# EAGLE schematic main multicore (EAGLE 7.2.0)
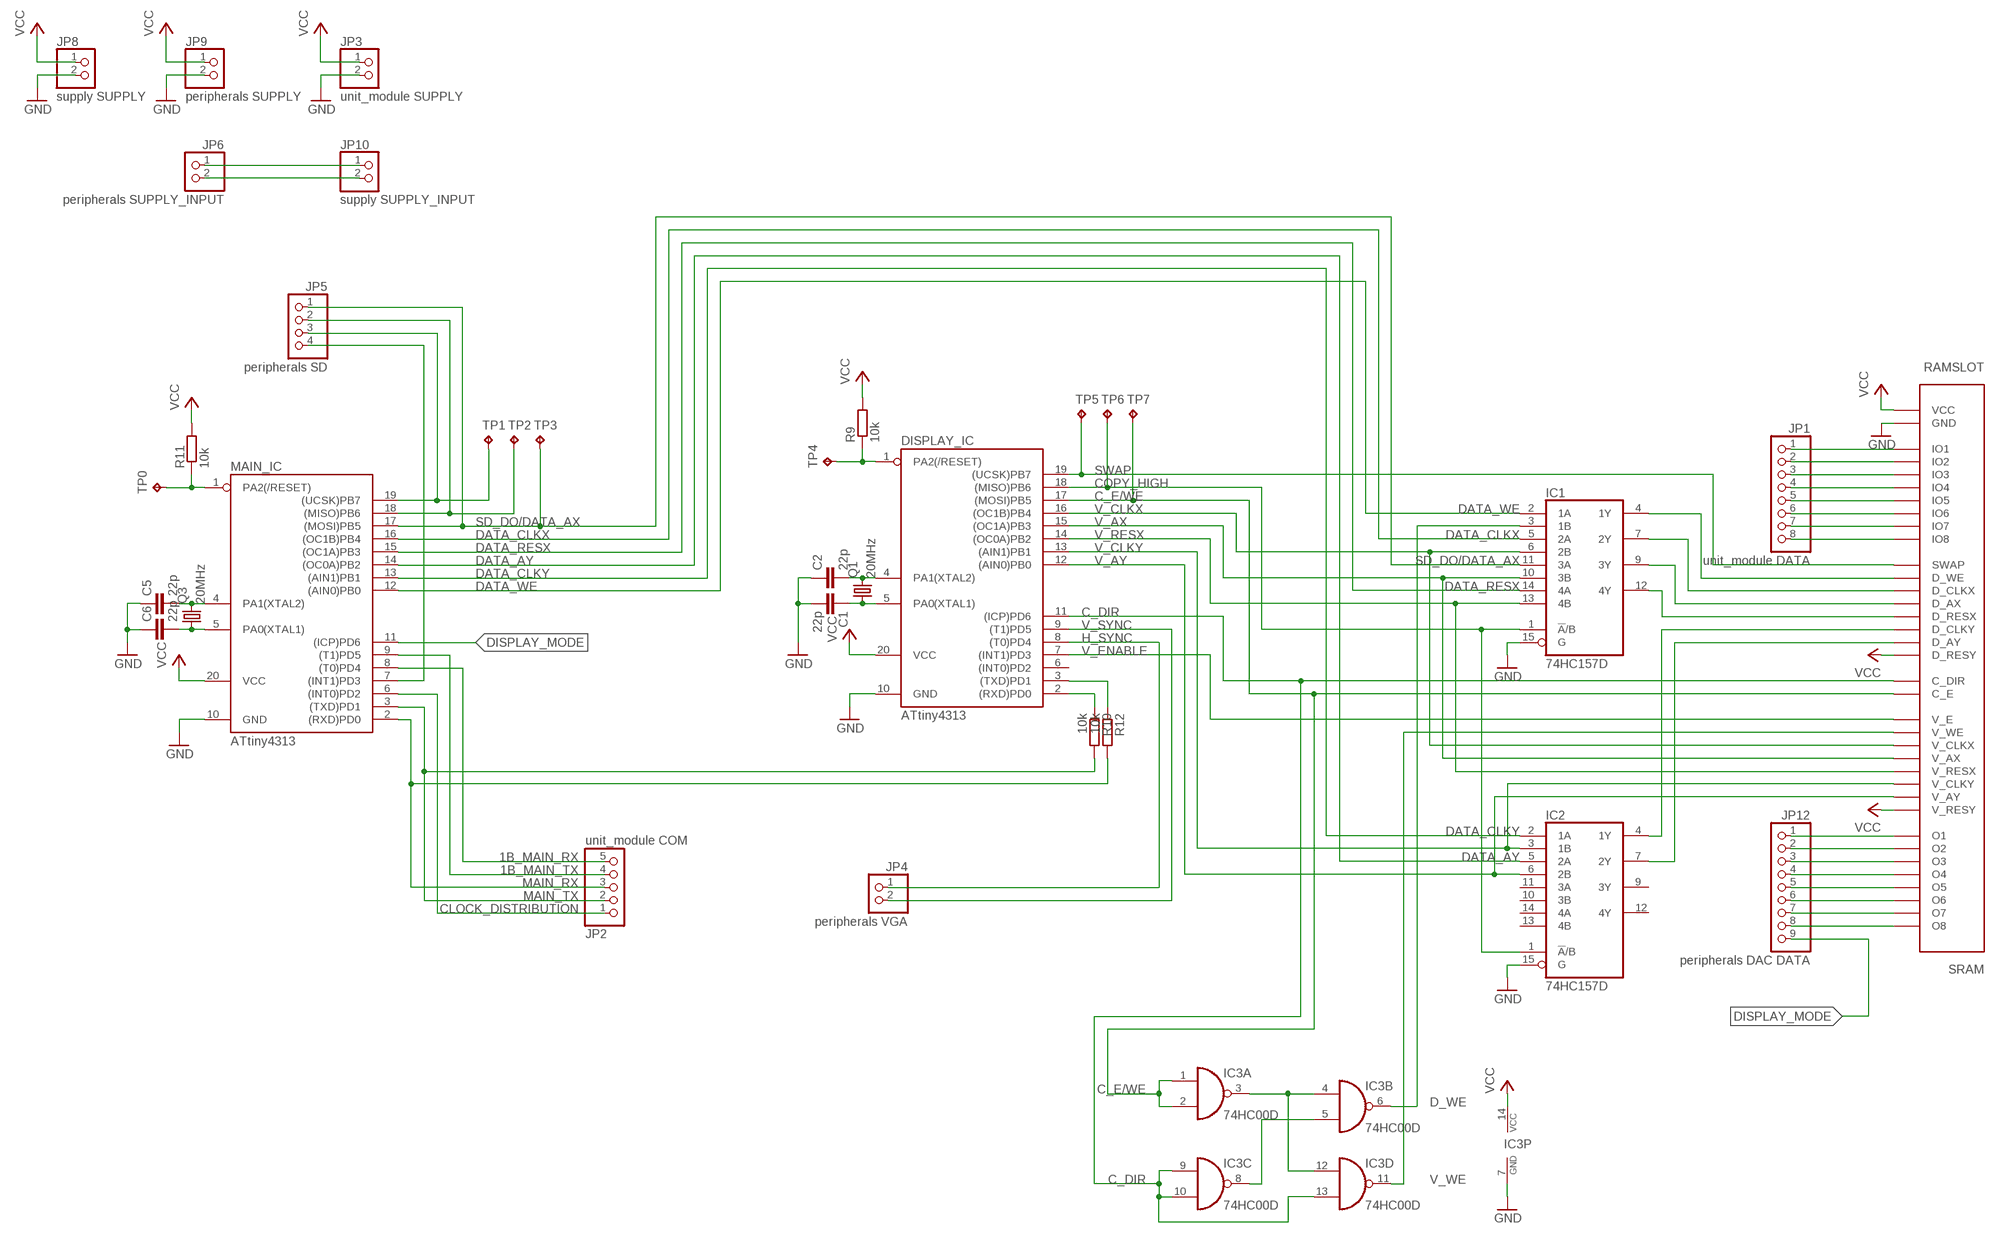
[diagram p0: schematic, sheet 1]

## Parts
C1  22p  C-EUC0402  [C0402]
C2  22p  C-EUC0402  [C0402]
C5  22p  C-EUC0402  [C0402]
C6  22p  C-EUC0402  [C0402]
DISPLAY_IC  ATtiny4313  TINY2313-*S*  [SO20L$]
IC1  74HC157D  [SO16]
IC2  74HC157D  [SO16]
IC3  74HC00D  [SO14]
JP1  unit_module DATA  PINHD-1X8  [1X08]
JP2  unit_module COM  PINHD-1X5  [1X05]
JP3  unit_module SUPPLY  PINHD-1X2  [1X02]
JP4  peripherals VGA  PINHD-1X2  [1X02]
JP5  peripherals SD  PINHD-1X4  [1X04]
JP6  peripherals SUPPLY_INPUT  PINHD-1X2  [1X02]
JP8  supply SUPPLY  PINHD-1X2  [1X02]
JP9  peripherals SUPPLY  PINHD-1X2  [1X02]
JP10  supply SUPPLY_INPUT  PINHD-1X2  [1X02]
JP12  peripherals DAC DATA  PINHD-1X9  [1X09]
MAIN_IC  ATtiny4313  TINY2313-*S*  [SO20L$]
Q1  20MHz  MC-405  [MC-405]
Q3  20MHz  MC-405  [MC-405]
R9  10k  R-EU_R0603  [R0603]
R10  10k  R-EU_R0603  [R0603]
R11  10k  R-EU_R0603  [R0603]
R12  10k  R-EU_R0603  [R0603]
RAMSLOT  SRAM  SLOT  [SLOT]
TP0  TPB1,27  [B1,27]
TP1  TPB1,27  [B1,27]
TP2  TPB1,27  [B1,27]
TP3  TPB1,27  [B1,27]
TP4  TPB1,27  [B1,27]
TP5  TPB1,27  [B1,27]
TP6  TPB1,27  [B1,27]
TP7  TPB1,27  [B1,27]

## Nets
1B_MAIN_RX: JP2.5 MAIN_IC.8((T0)PD4)
1B_MAIN_TX: JP2.4 MAIN_IC.9((T1)PD5)
C_DIR: DISPLAY_IC.11((ICP)PD6) IC3.9(C:I0) IC3.10(C:I1) IC3.13(D:I1) RAMSLOT.C_DIR
C_E/WE: DISPLAY_IC.17((MOSI)PB5) IC3.1(A:I0) IC3.2(A:I1) RAMSLOT.C_E TP7.TP
CLOCK_DISTRIBUTION: JP2.1 MAIN_IC.6((INT0)PD2)
COPY_HIGH: DISPLAY_IC.18((MISO)PB6) IC1.1(!A!/B) IC2.1(!A!/B) TP6.TP
D_WE: IC1.3(1B) IC3.6(B:O)
DATA_AY: IC2.5(2A) MAIN_IC.14((OC0A)PB2)
DATA_CLKX: IC1.5(2A) MAIN_IC.16((OC1B)PB4)
DATA_CLKY: IC2.2(1A) MAIN_IC.13((AIN1)PB1)
DATA_RESX: IC1.14(4A) MAIN_IC.15((OC1A)PB3)
DATA_WE: IC1.2(1A) MAIN_IC.12((AIN0)PB0)
DISPLAY_MODE: JP12.9 MAIN_IC.11((ICP)PD6)
GND: C1.2 C2.1 C5.1 C6.1 DISPLAY_IC.10(GND) IC1.15(G) IC2.15(G) IC3.7(P:GND) JP3.2 JP8.2 JP9.2 MAIN_IC.10(GND) RAMSLOT.GND
H_SYNC: DISPLAY_IC.8((T0)PD4) JP4.1
IN_GND: JP6.2 JP10.2
IN_VCC: JP6.1 JP10.1
MAIN_RX: JP2.3 MAIN_IC.2((RXD)PD0) R12.2
MAIN_TX: JP2.2 MAIN_IC.3((TXD)PD1) R10.2
N$3: IC3.3(A:O) IC3.4(B:I0) IC3.12(D:I0)
N$4: IC3.5(B:I1) IC3.8(C:O)
N$9: JP1.1 RAMSLOT.IO1
N$12: DISPLAY_IC.1(PA2(/RESET)) R9.1 TP4.TP
N$13: JP1.2 RAMSLOT.IO2
N$14: JP1.3 RAMSLOT.IO3
N$15: DISPLAY_IC.3((TXD)PD1) R12.1
N$16: C5.2 MAIN_IC.4(PA1(XTAL2)) Q3.2
N$17: C6.2 MAIN_IC.5(PA0(XTAL1)) Q3.1
N$18: MAIN_IC.1(PA2(/RESET)) R11.1 TP0.TP
N$19: JP1.4 RAMSLOT.IO4
N$20: JP1.5 RAMSLOT.IO5
N$21: JP1.6 RAMSLOT.IO6
N$22: JP1.7 RAMSLOT.IO7
N$23: JP1.8 RAMSLOT.IO8
N$24: DISPLAY_IC.2((RXD)PD0) R10.1
N$30: C1.1 DISPLAY_IC.5(PA0(XTAL1)) Q1.1
N$31: C2.2 DISPLAY_IC.4(PA1(XTAL2)) Q1.2
N$39: JP12.1 RAMSLOT.O1
N$40: JP12.2 RAMSLOT.O2
N$41: JP12.3 RAMSLOT.O3
N$42: JP12.4 RAMSLOT.O4
N$43: JP12.5 RAMSLOT.O5
N$44: JP12.6 RAMSLOT.O6
N$45: JP12.7 RAMSLOT.O7
N$46: JP12.8 RAMSLOT.O8
N$47: IC1.4(1Y) RAMSLOT.D_WE
N$48: IC1.7(2Y) RAMSLOT.D_CLKX
N$49: IC1.9(3Y) RAMSLOT.D_AX
N$50: IC1.12(4Y) RAMSLOT.D_RESX
N$51: IC2.4(1Y) RAMSLOT.D_CLKY
N$52: IC2.7(2Y) RAMSLOT.D_AY
SD_CS: JP5.4 MAIN_IC.7((INT1)PD3)
SD_DI: JP5.2 MAIN_IC.18((MISO)PB6) TP2.TP
SD_DO/DATA_AX: IC1.11(3A) JP5.1 MAIN_IC.17((MOSI)PB5) TP3.TP
SD_SCLK: JP5.3 MAIN_IC.19((UCSK)PB7) TP1.TP
SWAP: DISPLAY_IC.19((UCSK)PB7) RAMSLOT.SWAP TP5.TP
V_AX: DISPLAY_IC.15((OC1A)PB3) IC1.10(3B) RAMSLOT.V_AX
V_AY: DISPLAY_IC.12((AIN0)PB0) IC2.6(2B) RAMSLOT.V_AY
V_CLKX: DISPLAY_IC.16((OC1B)PB4) IC1.6(2B) RAMSLOT.V_CLKX
V_CLKY: DISPLAY_IC.13((AIN1)PB1) IC2.3(1B) RAMSLOT.V_CLKY
V_ENABLE: DISPLAY_IC.7((INT1)PD3) RAMSLOT.V_E
V_RESX: DISPLAY_IC.14((OC0A)PB2) IC1.13(4B) RAMSLOT.V_RESX
V_SYNC: DISPLAY_IC.9((T1)PD5) JP4.2
V_WE: IC3.11(D:O) RAMSLOT.V_WE
VCC: DISPLAY_IC.20(VCC) IC3.14(P:VCC) JP3.1 JP8.1 JP9.1 MAIN_IC.20(VCC) R9.2 R11.2 RAMSLOT.D_RESY RAMSLOT.V_RESY RAMSLOT.VCC
Unconnected: DISPLAY_IC.6((INT0)PD2) IC2.9(3Y) IC2.10(3B) IC2.11(3A) IC2.12(4Y) IC2.13(4B) IC2.14(4A)

## Power pins joined to a net without a drawn wire
GND: IC1.8(GND) IC2.8(GND)
VCC: IC1.16(VCC) IC2.16(VCC)

## Library data of the parts
C1 C2 C5 C6 = rcl:C-EU: CAPACITOR, European symbol
DISPLAY_IC MAIN_IC = avr-7:TINY2313*: Atmel Tiny2313 2K Flash, 128 bytes EEPROM, 128 bytes RAM
IC1 IC2 = 74xx-eu:74*157: Quadruple 2-line to 1-line data SELECTOR/MULTIPLEXER
IC3 = 74xx-eu:74*00: Quad 2-input NAND gate
JP1 = pinhead:PINHD-1X8: PIN HEADER
JP2 = pinhead:PINHD-1X5: PIN HEADER
JP3 JP4 JP6 JP8-JP10 = pinhead:PINHD-1X2: PIN HEADER
JP5 = pinhead:PINHD-1X4: PIN HEADER
JP12 = pinhead:PINHD-1X9: PIN HEADER
Q1 Q3 = crystal:MC-405: kHz RANGE CRYSTAL UNIT SMD Source: MC-306_405_406_E07X.PDF Homepage <http://www.epsontoyocom.co.jp>; OC_FARNELL: unknown; OC_NEWARK: unknown
R9-R12 = rcl:R-EU_: RESISTOR, European symbol
RAMSLOT = sramswapper_slot:SLOT
TP0 TP1-TP7 = testpad:TP: Test pad